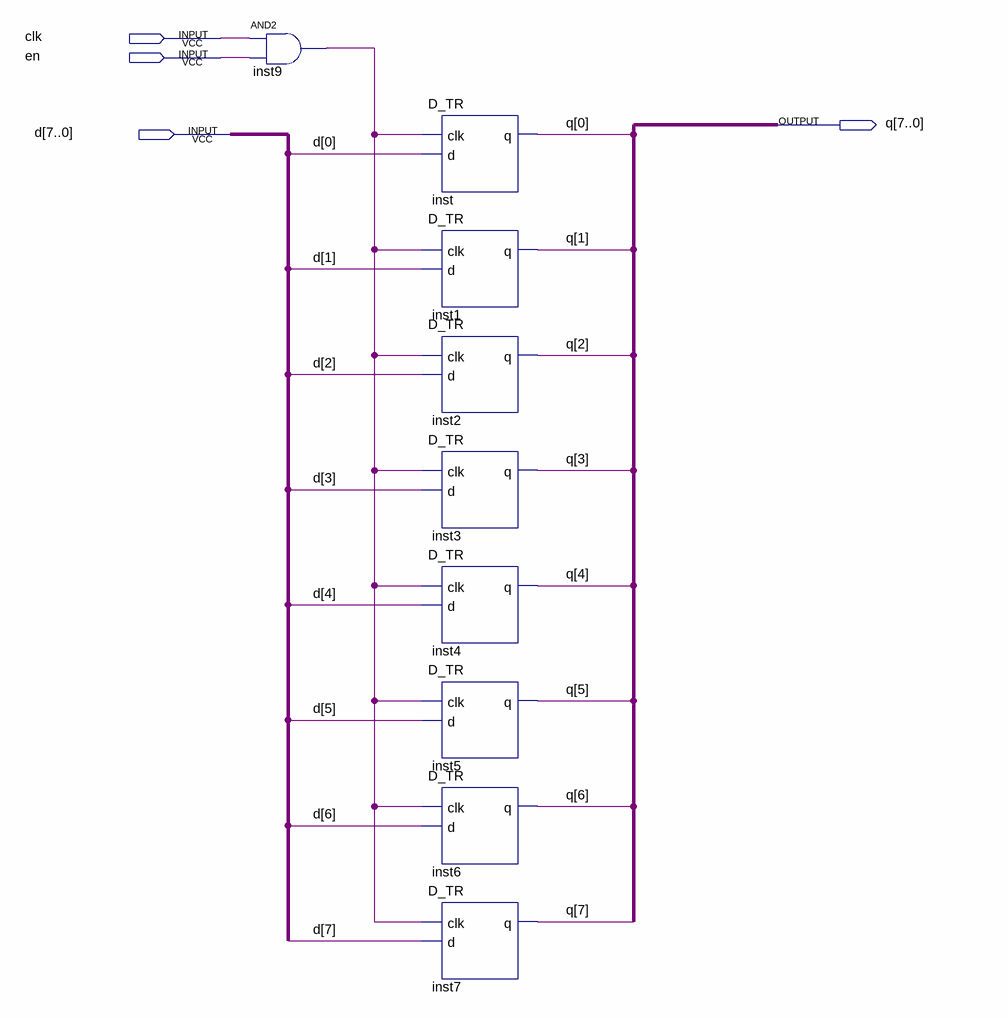
[diagram p0: schematic sheet]
// Quartus schematic parall_reg_8.bdf as structural Verilog: 9 symbols, 4 pins
module parall_reg_8 (
  input  clk,
  input  en,
  input  [7:0] d,
  output [7:0] q
);

  wire inst9_out;

  and inst9 (inst9_out, clk, en);
  D_TR inst (.clk(inst9_out), .d(d[0]), .q(q[0]));
  D_TR inst1 (.clk(inst9_out), .d(d[1]), .q(q[1]));
  D_TR inst2 (.clk(inst9_out), .d(d[2]), .q(q[2]));
  D_TR inst3 (.clk(inst9_out), .d(d[3]), .q(q[3]));
  D_TR inst4 (.clk(inst9_out), .d(d[4]), .q(q[4]));
  D_TR inst5 (.clk(inst9_out), .d(d[5]), .q(q[5]));
  D_TR inst6 (.clk(inst9_out), .d(d[6]), .q(q[6]));
  D_TR inst7 (.clk(inst9_out), .d(d[7]), .q(q[7]));
endmodule
